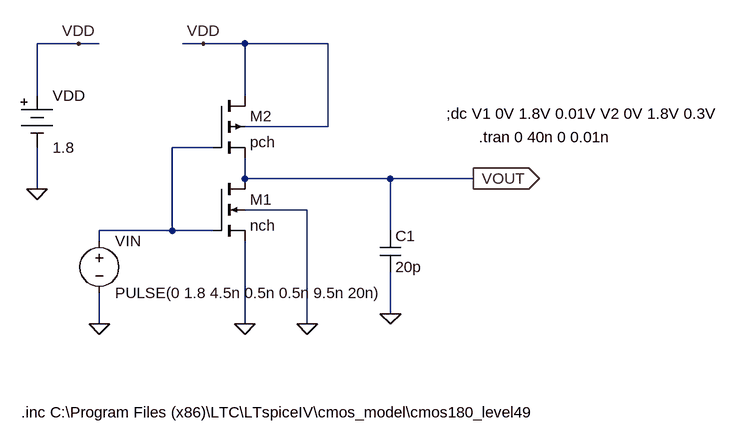
[diagram p0: schematic dc_sweep.asc]
dc_sweep.asc, the LTspice schematic file:
Version 4
SHEET 1 976 680
WIRE -64 -96 -128 -96
WIRE -32 -96 -64 -96
WIRE 128 -96 96 -96
WIRE 192 -96 128 -96
WIRE 320 -96 192 -96
WIRE -128 -16 -128 -96
WIRE 192 -16 192 -96
WIRE 320 32 320 -96
WIRE 320 32 192 32
WIRE 144 64 80 64
WIRE 192 112 192 80
WIRE 416 112 192 112
WIRE 544 112 416 112
WIRE -128 128 -128 64
WIRE 288 160 192 160
WIRE 80 192 80 64
WIRE 80 192 -32 192
WIRE 144 192 80 192
WIRE 416 192 416 112
WIRE -32 208 -32 192
WIRE 416 320 416 256
WIRE -32 336 -32 288
WIRE 192 336 192 208
WIRE 288 336 288 160
FLAG -32 336 0
FLAG 192 336 0
FLAG 288 336 0
FLAG 416 320 0
FLAG -128 128 0
FLAG 544 112 VOUT
IOPIN 544 112 Out
FLAG -64 -96 VDD
FLAG 128 -96 VDD
SYMBOL nmos4 144 112 R0
SYMATTR InstName M1
SYMATTR Value nch
SYMATTR Value2 l=0.18u w=20u
SYMBOL voltage -32 192 R0
WINDOW 123 0 0 Left 2
WINDOW 39 0 0 Left 2
SYMATTR InstName VIN
SYMATTR Value PULSE(0 1.8 4.5n 0.5n 0.5n 9.5n 20n)
SYMBOL pmos4 144 -16 R0
SYMATTR InstName M2
SYMATTR Value pch
SYMATTR Value2 l=0.18u w=50u
SYMBOL Misc\\battery -128 -32 R0
WINDOW 123 0 0 Left 2
WINDOW 39 0 0 Left 2
SYMATTR InstName VDD
SYMATTR Value 1.8
SYMBOL cap 400 192 R0
SYMATTR InstName C1
SYMATTR Value 20p
TEXT -152 472 Left 2 !.inc C:\\Program Files (x86)\\LTC\\LTspiceIV\\cmos_model\\cmos180_level49
TEXT 502 12 Left 2 !;dc V1 0V 1.8V 0.01V V2 0V 1.8V 0.3V
TEXT 552 48 Left 2 !.tran 0 40n 0 0.01n

The netlist it stands for:
* dc_sweep.asc
M1 VOUT N001 0 0 nch l=0.18u w=20u
VIN N001 0 PULSE(0 1.8 4.5n 0.5n 0.5n 9.5n 20n)
M2 VDD N001 VOUT VDD pch l=0.18u w=50u
VDD VDD 0 1.8
C1 VOUT 0 20p
.model NMOS NMOS
.model PMOS PMOS
.lib standard.mos
.inc C:\Program Files (x86)\LTC\LTspiceIV\cmos_model\cmos180_level49
;dc V1 0V 1.8V 0.01V V2 0V 1.8V 0.3V
.tran 0 40n 0 0.01n
.backanno
.end